# Altium project Node.PrjPCB
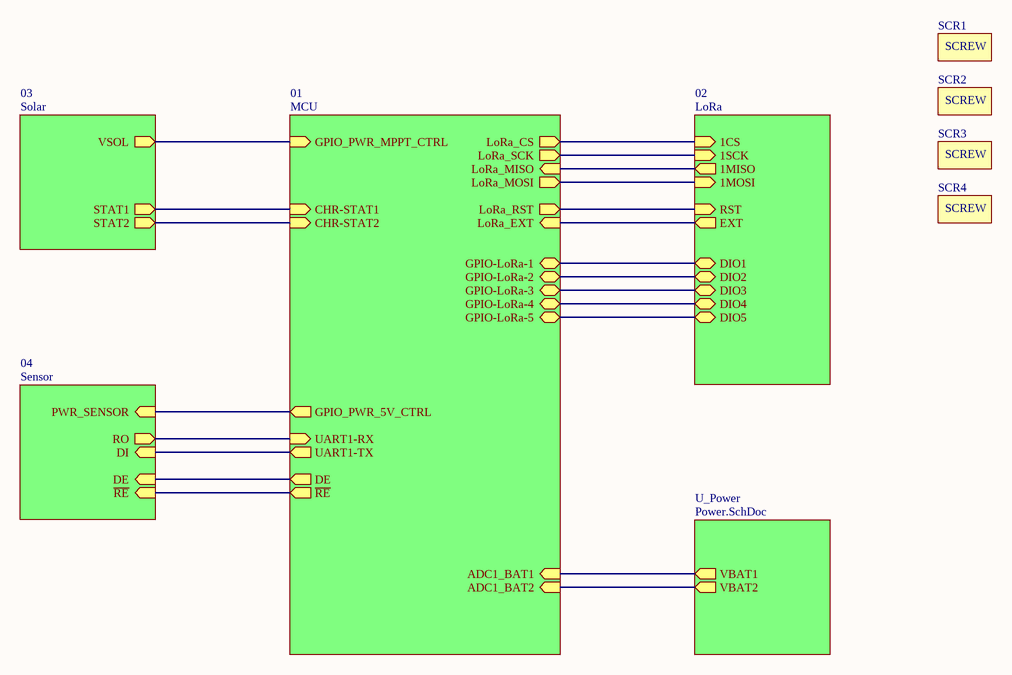
[diagram p0: Main.SchDoc]
6 sheets, 135 parts. Net scope: hierarchical (ports join the sheet entries above them; power ports are global).
Board file: Node_v2.PcbDoc
Sheets:
  Main.SchDoc
    03 = Solar.SchDoc
    01 = MCU.SchDoc
    02 = LoRa.SchDoc
    04 = Sensor.SchDoc
    U_Power = Power.SchDoc

## Sheet Main.SchDoc: =ProjectName
size A4; CheckedBy: DatNB; Author: Ven; CompanyName: Nacentech; Organization: IMET

### Parts
SCR1  Screw 3mm  [SCREW]  (value not drawn)
SCR2  Screw 3mm  [SCREW]  (value not drawn)
SCR3  Screw 3mm  [SCREW]  (value not drawn)
SCR4  Screw 3mm  [SCREW]  (value not drawn)

### Sub-sheets
01 = MCU: LoRa_MOSI (out), LoRa_MISO (in), GPIO-LoRa-3 (bidir), GPIO-LoRa-4 (bidir), CHR-STAT2 (in), CHR-STAT1 (in), DE (out), UART1-TX (out), GPIO-LoRa-1 (bidir), GPIO-LoRa-2 (bidir), ADC1_BAT2 (in), ADC1_BAT1 (in), LoRa_RST (out), LoRa_CS (out), LoRa_EXT (in), GPIO-LoRa-5 (bidir), UART1-RX (in), LoRa_SCK (out), ~{RE} (out), GPIO_PWR_5V_CTRL (out), GPIO_PWR_MPPT_CTRL (in)
02 = LoRa: 1CS (in), 1MOSI (in), EXT (out), 1MISO (out), 1SCK (in), RST (in), DIO4 (bidir), DIO5 (bidir), DIO1 (bidir), DIO3 (bidir), DIO2 (bidir)
03 = Solar: STAT1 (out), VSOL (out), STAT2 (out)
04 = Sensor: ~{RE} (in), RO (out), DI (in), DE (in), PWR_SENSOR (in)
U_Power = Power.SchDoc: VBAT1 (out), VBAT2 (out)

### Nets
NetC5_1: sheet 01/ADC1_BAT1, sheet U_Power/VBAT1
NetC6_1: sheet 01/ADC1_BAT2, sheet U_Power/VBAT2
NetIC2_2: sheet 01/~{RE}, sheet 04/~{RE}
NetIC2_3: sheet 01/DE, sheet 04/DE
NetR4_2: sheet 01/GPIO-LoRa-1, sheet 02/DIO1
NetR15_2: sheet 01/UART1-RX, sheet 04/RO
NetR17_2: sheet 01/GPIO_PWR_5V_CTRL, sheet 04/PWR_SENSOR
NetR18_2: sheet 01/UART1-TX, sheet 04/DI
NetR42_1: sheet 03/STAT1, sheet 01/CHR-STAT1
NetR43_1: sheet 03/STAT2, sheet 01/CHR-STAT2
NetR46_2: sheet 03/VSOL, sheet 01/GPIO_PWR_MPPT_CTRL
NetU1_4: sheet 01/LoRa_RST, sheet 02/RST
NetU1_5: sheet 01/LoRa_EXT, sheet 02/EXT
NetU1_7: sheet 01/GPIO-LoRa-2, sheet 02/DIO2
NetU1_8: sheet 01/GPIO-LoRa-3, sheet 02/DIO3
NetU1_10: sheet 01/GPIO-LoRa-4, sheet 02/DIO4
NetU1_11: sheet 01/GPIO-LoRa-5, sheet 02/DIO5
NetU1_12: sheet 01/LoRa_SCK, sheet 02/1SCK
NetU1_13: sheet 01/LoRa_MISO, sheet 02/1MISO
NetU1_14: sheet 01/LoRa_MOSI, sheet 02/1MOSI
NetU1_15: sheet 01/LoRa_CS, sheet 02/1CS

Not connected (* = marked no-connect by the designer): SCR1 0; SCR2 0; SCR3 0; SCR4 0

### Notes on the sheet
- Project:
- Page Contents:
- Size:
- Date:
- A4
- Checked by:
- Time:
- Revision:
- Sheet
- of
- File:
- (in symbol screw3m) SCREW

### Library data of the parts
SCR1-SCR4 = screw3m

## Sheet Solar.SchDoc: =ProjectName
size A4; CheckedBy: DatNB; Author: Ven; CompanyName: Nacentech; Organization: IMET
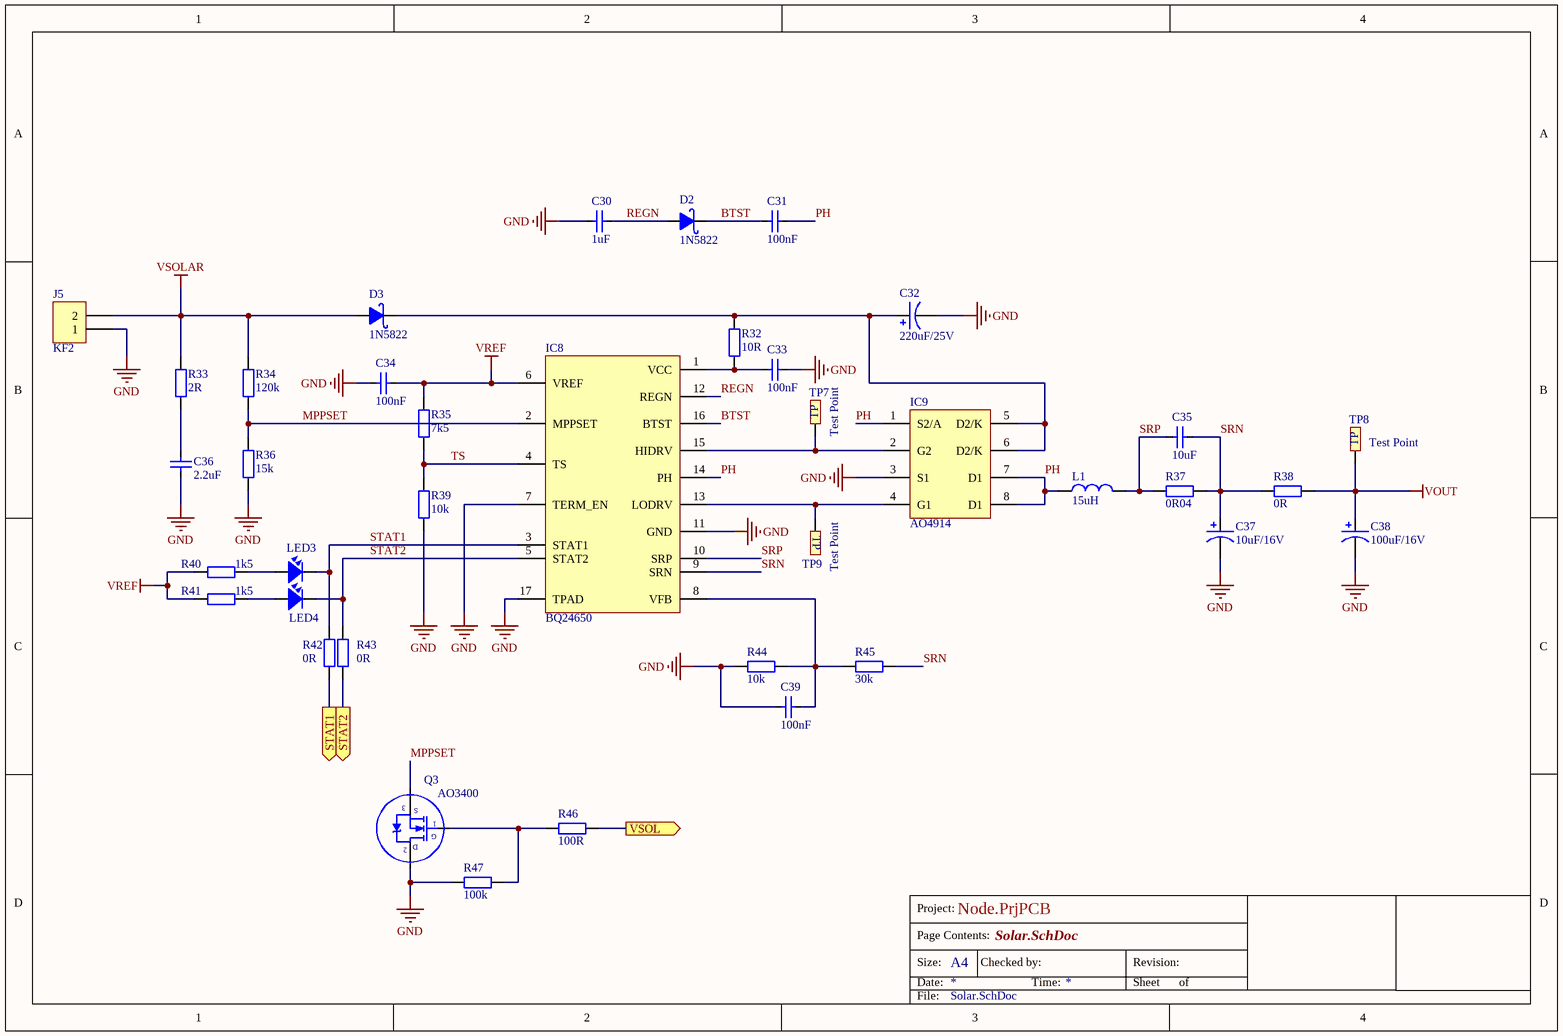
[diagram p1: Solar.SchDoc]

### Parts
C30  1uF  [CAP_0805]
C31  100nF  [CAP_0805]
C32  220uF/25V  [C5mm]
C33  100nF  [CAP_0805]
C34  100nF  [CAP_0805]
C35  10uF  [CAP_0805]
C36  2.2uF  [CAP_0805]
C37  10uF/16V  [C5mm]
C38  100uF/16V  [C5mm]
C39  100nF  [CAP_0805]
D2  1N5822  [DIO-214AC(SMA)]
D3  1N5822  [DIO-214AC(SMA)]
IC8  BQ24650  [VQFN-16]
IC9  AO4914  [SOIC-8]
J5  KF2  [KF2-5.08]
L1  15uH  [L-SMD-M-7.3x4.5]
LED3  LED  [LED-0805-Red]  (value not drawn)
LED4  LED  [LED-0805-Orange]  (value not drawn)
Q3  AO3400  [SOT23A]
R32  10R  [RES-SMD-0805]
R33  2R  [RES-SMD-0805]
R34  120k  [RES-SMD-0805]
R35  7k5  [RES-SMD-0805]
R36  15k  [RES-SMD-0805]
R37  0R04  [RES-SMD-2512]
R38  0R  [RES-SMD-2512]
R39  10k  [RES-SMD-0805]
R40  1k5  [RES-SMD-0805]
R41  1k5  [RES-SMD-0805]
R42  0R  [RES-SMD-0805]
R43  0R  [RES-SMD-0805]
R44  10k  [RES-SMD-0805]
R45  30k  [RES-SMD-0805]
R46  100R  [RES-SMD-0805]
R47  100k  [RES-SMD-0805]
TP7  Test Point  [TP_SMD]
TP8  Test Point  [TP_SMD]
TP9  Test Point  [TP_SMD]

### Ports
STAT1 (out), STAT2 (out), VSOL (out)

### Nets
GND: C30.2 C32.2 C33.2 C34.2 C36.1 C37.2 C38.2 C39.1 IC8.7(TERM_EN) IC8.11(GND) IC8.17(TPAD) IC9.3(S1) J5.1 Q3.2(D) R36.2 R39.1 R44.1 R47.2
VOUT: C38.1 R38.2 TP8.1
VREF: C34.1 IC8.6(VREF) R35.1 R40.1 R41.1
VSOLAR: D3.1(A) J5.2 R33.1 R34.2
BTST: C31.1 D2.2(K) IC8.16(BTST)
MPPSET: IC8.2(MPPSET) Q3.3(S) R34.1 R36.1
PH: C31.2 IC8.14(PH) IC9.1(S2/A) IC9.7(D1) IC9.8(D1) L1.1
REGN: C30.1 D2.1(A) IC8.12(REGN)
SRN: C35.1 C37.1 IC8.9(SRN) R37.2 R38.1 R45.1
SRP: C35.2 IC8.10(SRP) L1.2 R37.1
STAT1: IC8.3(STAT1) LED3.2 R42.2
STAT2: IC8.5(STAT2) LED4.2 R43.2
TS: IC8.4(TS) R35.2 R39.2
NetC32_1: C32.1 D3.2(K) IC9.5(D2/K) IC9.6(D2/K) R32.1
NetC33_1: C33.1 IC8.1(VCC) R32.2
NetC36_2: C36.2 R33.2
NetC39_2: C39.2 IC8.8(VFB) R44.2 R45.2
NetIC8_13: IC8.13(LODRV) IC9.4(G1) TP9.1
NetIC8_15: IC8.15(HIDRV) IC9.2(G2) TP7.1
NetLED3_1: LED3.1 R40.2
NetLED4_1: LED4.1 R41.2
NetQ3_1: Q3.1(G) R46.1 R47.1
NetR42_1: R42.1 ; port STAT1
NetR43_1: R43.1 ; port STAT2
NetR46_2: R46.2 ; port VSOL

### Notes on the sheet
- Project:
- Page Contents:
- Size:
- Date:
- A4
- Checked by:
- Time:
- Revision:
- Sheet
- of
- File:

### Library data of the parts
C30 C31 C33-C36 C39 = CapSMD: Capacitor; Value: 33p; Published: 8-Jun-2000; LatestRevisionDate: 17-Jul-2002; LatestRevisionNote: Re-released for DXP Platform.; PackageReference: RAD-0.3; Publisher: Altium Limited
C32 C37 C38 = Cap Pol: Polarized Capacitor (Axial); Published: 8-Jun-2000; LatestRevisionDate: 17-Jul-2002; LatestRevisionNote: Re-released for DXP Platform.; PackageReference: POLAR0.8; Publisher: Altium Limited
D2 D3 = 1N5822: Schottky Rectifiers; Value: Diode c?m 1N5408
IC8 = BQ24650: BQ24650 Stand-Alone Synchronous Buck Battery Charge Controller for Solar Power / With Maximum Power Point Tracking
IC9 = AO4914: Dual N-Channel Enhancement Mode Field Effect Transistor with Schottky Diode
J5 = KF2: Manufacturer: Würth Elektronik eiSos GmbH; partNo: 691103110002; ComponentLink1 Description: Manufacturer; ComponentLink2 Description: Datasheet; NoPins: 2; Created Date: 29 October 2013; ComponentLink1URL: http://www.we-online.com; ComponentLink2URL: http://katalog.we-online.de/em/datasheet/6911031100xx.pdf; Created by: Karrer Zheng
L1 = Inductor: Value: 150 mH
LED3 LED4 = LED: LED Single colour Green and Red; Value: LED 3 ly Single Colour
Q3 = MOSFET_N: Generic N Channel MOSFET
R32-R47 = Resistor - SMD: Resistor SMD; Manufacturer: Generic Components; Class: Passive; Published: 08/06/2000; Publisher: Altium Hobart Technology Centre
TP7-TP9 = TP: CONNECT 1

## Sheet MCU.SchDoc: =ProjectName
size A4; CheckedBy: DatNB; Author: Ven; CompanyName: Nacentech; Organization: IMET
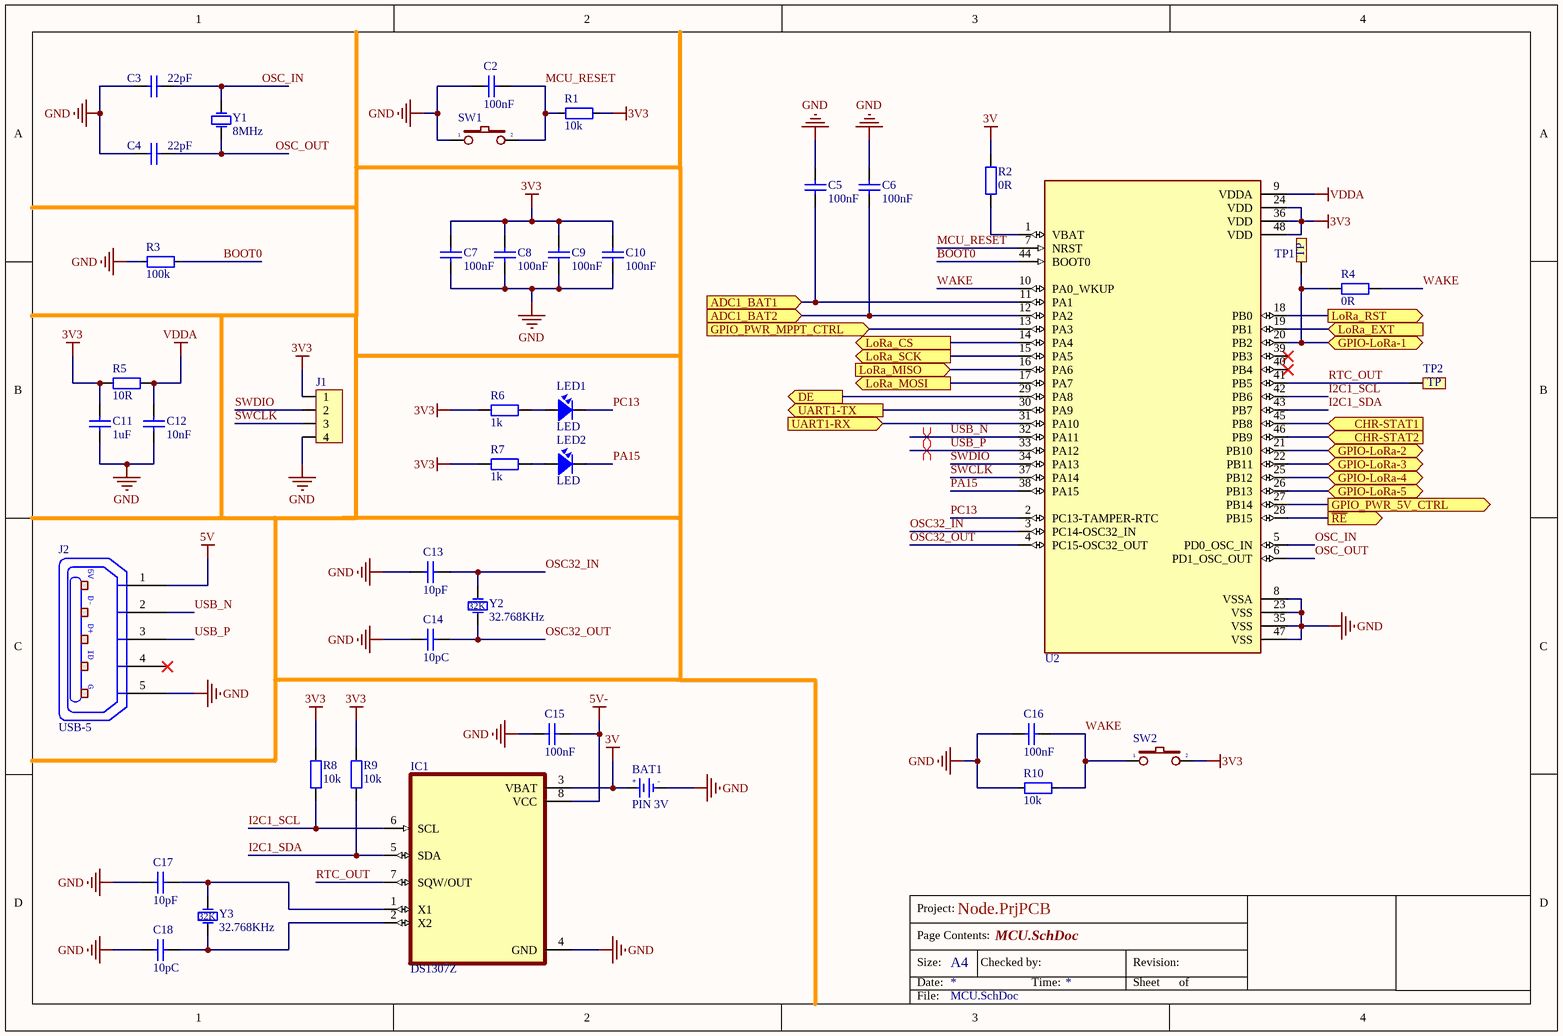
[diagram p2: MCU.SchDoc]

### Parts
BAT1  PIN 3V  [CR1220 SMD]
C2  100nF  [CAP_0805]
C3  22pF  [CAP_0805]
C4  22pF  [CAP_0805]
C5  100nF  [CAP_0805]
C6  100nF  [CAP_0805]
C7  100nF  [CAP_0805]
C8  100nF  [CAP_0805]
C9  100nF  [CAP_0805]
C10  100nF  [CAP_0805]
C11  1uF  [CAP_0805]
C12  10nF  [CAP_0805]
C13  10pF  [CAP_0805]
C14  10pC  [CAP_0805]
C15  100nF  [CAP_0805]
C16  100nF  [CAP_0805]
C17  10pF  [CAP_0805]
C18  10pC  [CAP_0805]
IC1  DS1307Z  [SOIC-8]
J1  ST_Link  [HEADER4P-1.25]  (value not drawn)
J2  USB-5  [USB-M1]
LED1  LED  [LED-0805-Red]
LED2  LED  [LED-0805-Yellow]
R1  10k  [RES-SMD-0805]
R2  0R  [RES-SMD-0805]
R3  100k  [RES-SMD-0805]
R4  0R  [RES-SMD-0805]
R5  10R  [RES-SMD-0805]
R6  1k  [RES-SMD-0805]
R7  1k  [RES-SMD-0805]
R8  10k  [RES-SMD-0805]
R9  10k  [RES-SMD-0805]
R10  10k  [RES-SMD-0805]
SW1  SW  [SW 3x2x4]  (value not drawn)
SW2  SW  [SW 3x2x4]  (value not drawn)
TP1  Test Point  [TP_SMD]  (value not drawn)
TP2  Test Point  [TP_SMD]  (value not drawn)
U2  STM32  [LQFP 48]  (value not drawn)
Y1  8MHz  [XTAL]
Y2  32.768KHz  [XTAL32K]
Y3  32.768KHz  [XTAL32K]

### Ports
ADC1_BAT1 (in), ADC1_BAT2 (in), CHR-STAT1 (in), CHR-STAT2 (in), DE (out), GPIO-LoRa-1 (bidir), GPIO-LoRa-2 (bidir), GPIO-LoRa-3 (bidir), GPIO-LoRa-4 (bidir), GPIO-LoRa-5 (bidir), GPIO_PWR_5V_CTRL (out), GPIO_PWR_MPPT_CTRL (in), LoRa_CS (out), LoRa_EXT (in), LoRa_MISO (in), LoRa_MOSI (out), LoRa_RST (out), LoRa_SCK (out), UART1-RX (in), UART1-TX (out), ~{RE} (out)

### Nets
3V: BAT1.1(+3V) IC1.3(VBAT) R2.2
3V3: C7.2 C8.2 C9.2 C10.2 C11.2 J1.1 R1.1 R5.1 R6.1 R7.1 R8.2 R9.2 SW2.2 U2.24(VDD) U2.36(VDD) U2.48(VDD)
5V: J2.1(P1)
5V-: C15.2 IC1.8(VCC)
GND: BAT1.2(GND) C2.1 C3.1 C4.1 C5.2 C6.2 C7.1 C8.1 C9.1 C10.1 C11.1 C12.1 C13.2 C14.2 C15.1 C16.1 C17.2 C18.2 IC1.4(GND) J1.4 J2.5(P5) R3.2 R10.2 SW1.1 U2.8(VSSA) U2.23(VSS) U2.35(VSS) U2.47(VSS)
VDDA: C12.2 R5.2 U2.9(VDDA)
BOOT0: R3.1 U2.44(BOOT0)
I2C1_SCL: IC1.6(SCL) R8.1 U2.42(PB6)
I2C1_SDA: IC1.5(SDA) R9.1 U2.43(PB7)
MCU_RESET: C2.2 R1.2 SW1.2 U2.7(NRST)
OSC32_IN: C13.1 U2.3(PC14-OSC32_IN) Y2.1(OSC1)
OSC32_OUT: C14.1 U2.4(PC15-OSC32_OUT) Y2.2(OSC2)
OSC_IN: C3.2 U2.5(PD0_OSC_IN) Y1.1(OSC1)
OSC_OUT: C4.2 U2.6(PD1_OSC_OUT) Y1.2(OSC2)
PA15: LED2.2 U2.38(PA15)
PC13: LED1.2 U2.2(PC13-TAMPER-RTC)
RTC_OUT: IC1.7(SQW/OUT) TP2.1 U2.41(PB5)
SWCLK: J1.3 U2.37(PA14)
SWDIO: J1.2 U2.34(PA13)
USB_N: J2.2(P2) U2.32(PA11)
USB_P: J2.3(P3) U2.33(PA12)
WAKE: C16.2 R4.1 R10.1 SW2.1 U2.10(PA0_WKUP)
NetC5_1: C5.1 U2.11(PA1) ; port ADC1_BAT1
NetC6_1: C6.1 U2.12(PA2) ; port ADC1_BAT2
NetC17_1: C17.1 IC1.1(X1) Y3.1(OSC1)
NetC18_1: C18.1 IC1.2(X2) Y3.2(OSC2)
NetIC2_2: U2.28(PB15) ; port ~{RE}
NetIC2_3: U2.29(PA8) ; port DE
NetLED1_1: LED1.1 R6.2
NetLED2_1: LED2.1 R7.2
NetR2_1: R2.1 U2.1(VBAT)
NetR4_2: R4.2 TP1.1 U2.20(PB2) ; port GPIO-LoRa-1
NetR15_2: U2.31(PA10) ; port UART1-RX
NetR17_2: U2.27(PB14) ; port GPIO_PWR_5V_CTRL
NetR18_2: U2.30(PA9) ; port UART1-TX
NetR42_1: U2.45(PB8) ; port CHR-STAT1
NetR43_1: U2.46(PB9) ; port CHR-STAT2
NetR46_2: U2.13(PA3) ; port GPIO_PWR_MPPT_CTRL
NetU1_4: U2.18(PB0) ; port LoRa_RST
NetU1_5: U2.19(PB1) ; port LoRa_EXT
NetU1_7: U2.21(PB10) ; port GPIO-LoRa-2
NetU1_8: U2.22(PB11) ; port GPIO-LoRa-3
NetU1_10: U2.25(PB12) ; port GPIO-LoRa-4
NetU1_11: U2.26(PB13) ; port GPIO-LoRa-5
NetU1_12: U2.15(PA5) ; port LoRa_SCK
NetU1_13: U2.16(PA6) ; port LoRa_MISO
NetU1_14: U2.17(PA7) ; port LoRa_MOSI
NetU1_15: U2.14(PA4) ; port LoRa_CS

Not connected (* = marked no-connect by the designer): J2 4(P4)*; U2 39(PB3)* 40(PB4)*

### Layout directives
differential pair: USB_N, USB_P

### Notes on the sheet
- Project:
- Page Contents:
- Size:
- Date:
- A4
- Checked by:
- Time:
- Revision:
- Sheet
- of
- File:
- (in symbol USB-5) 5V; D-; D+; ID; G
- (in symbol XTAL/32KHz) 32K

### Library data of the parts
BAT1 = PIN 3V: Battery 3VDC; Value: PIN 3V
C2-C18 = CapSMD: Capacitor; Value: 33p; Published: 8-Jun-2000; LatestRevisionDate: 17-Jul-2002; LatestRevisionNote: Re-released for DXP Platform.; PackageReference: RAD-0.3; Publisher: Altium Limited
J1 = Header4: Header IDC, 4 x 1 Pin Vertical 2.54mm Pitch (Non-Boxed, Male); Manufacturer: W¨¹rth Elektronik eiSos GmbH; partNo: 613002143121; ComponentLink1 Description: Manufacturer; ComponentLink2 Description: Datasheet; NoPins: 02; Created Date: 29 March 2013; ComponentLink1URL: http://www.we-online.com; ComponentLink2URL: http://katalog.we-online.de/em/datasheet/6130xx143121.pdf; Created by: Karrer Zheng
J2 = USB-5: Manufacturer: FCI; Manufacturer Part Number: 10118193-0001LF; Connector Type: USB - micro B; Number of Contacts: 5; Gender: Receptacle; Specifications: USB 2.0; .Creator: MM; .Checked PCB: RF; Supplier 1: Digi-Key; RoHS: RoHS Compliant; Category: Connectors, Interconnects; Stock 1: 28642; Pricing 1: 1=0.46, 10=0.433, 25=0.3712, 50=0.3156, 100=0.3032, 250=0.27224, 500=0.25988 (USD); Packaging: Cut Tape (CT); Mounting Type: Surface Mount, Right Angle, Horizontal; Features: Shielded, Solder Retention; Ingress Protection: -; ComponentLink1URL: http://portal.fciconnect.com/Comergent//fci/drawing/10118193.pdf; ComponentLink1Description: http://portal.fciconnect.com/Comergent//fci/drawing/10118193.pdf; Supplier Part Number 1: 609-4616-1-ND; .Checked SCH: MM
LED1 LED2 = LED: as LED3 on sheet Solar
R1 R3 R10 = Resistor - SMD: Resistor; Manufacturer: Generic Components; Class: Passive; Published: 08/06/2000; Publisher: Altium Hobart Technology Centre
R2 R4-R9 = Resistor - SMD: as R32 on sheet Solar; Published: 08/06/2000; Publisher: Altium Hobart Technology Centre
SW1 SW2 = SW2: Switch button 2 pin; Value: SW chip 2 pin
TP1 TP2 = TP: CONNECT 1
U2 = STM32F103C8T6: STM32 ARM-based 32-bit MCU with 64 Kbytes Flash, 64-pin LQFP, Industrial Temperature
Y1 = XTAL: Crystal Oscillator; Published: 8-Jun-2000; LatestRevisionDate: 17-Jul-2002; LatestRevisionNote: Re-released for DXP Platform.; PackageReference: R38; Publisher: Altium Limited
Y2 Y3 = XTAL/32KHz: Crystal Oscillator; Published: 8-Jun-2000; LatestRevisionDate: 17-Jul-2002; LatestRevisionNote: Re-released for DXP Platform.; PackageReference: R38; Publisher: Altium Limited

## Sheet LoRa.SchDoc: =ProjectName
size A4; CheckedBy: DatNB; Author: Ven; CompanyName: Nacentech; Organization: IMET
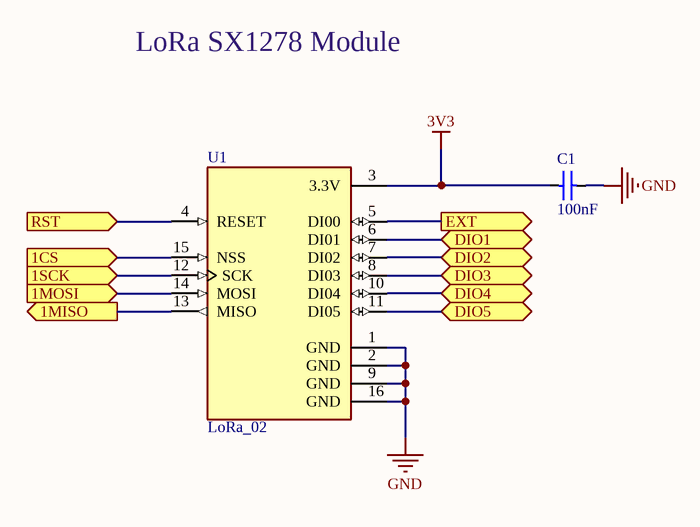
[diagram p3: LoRa.SchDoc]

### Parts
C1  100nF  [CAP_0805]
U1  LoRa_02  [Ra-02]

### Ports
1CS (in), 1MISO (out), 1MOSI (in), 1SCK (in), DIO1 (bidir), DIO2 (bidir), DIO3 (bidir), DIO4 (bidir), DIO5 (bidir), EXT (out), RST (in)

### Nets
3V3: C1.1 U1.3(3.3V)
GND: C1.2 U1.1(GND) U1.2(GND) U1.9(GND) U1.16(GND)
NetR4_2: U1.6(DI01) ; port DIO1
NetU1_4: U1.4(RESET) ; port RST
NetU1_5: U1.5(DI00) ; port EXT
NetU1_7: U1.7(DI02) ; port DIO2
NetU1_8: U1.8(DI03) ; port DIO3
NetU1_10: U1.10(DI04) ; port DIO4
NetU1_11: U1.11(DI05) ; port DIO5
NetU1_12: U1.12(SCK) ; port 1SCK
NetU1_13: U1.13(MISO) ; port 1MISO
NetU1_14: U1.14(MOSI) ; port 1MOSI
NetU1_15: U1.15(NSS) ; port 1CS

### Notes on the sheet
- LoRa SX1278 Module
- Project:
- Page Contents:
- Size:
- Date:
- A4
- Checked by:
- Time:
- Revision:
- Sheet
- of
- File:

### Library data of the parts
C1 = CapSMD: Capacitor; Value: 33p; Published: 8-Jun-2000; LatestRevisionDate: 17-Jul-2002; LatestRevisionNote: Re-released for DXP Platform.; PackageReference: RAD-0.3; Publisher: Altium Limited

## Sheet Sensor.SchDoc: =ProjectName
size A4; CheckedBy: DatNB; Author: Ven; CompanyName: Nacentech; Organization: IMET
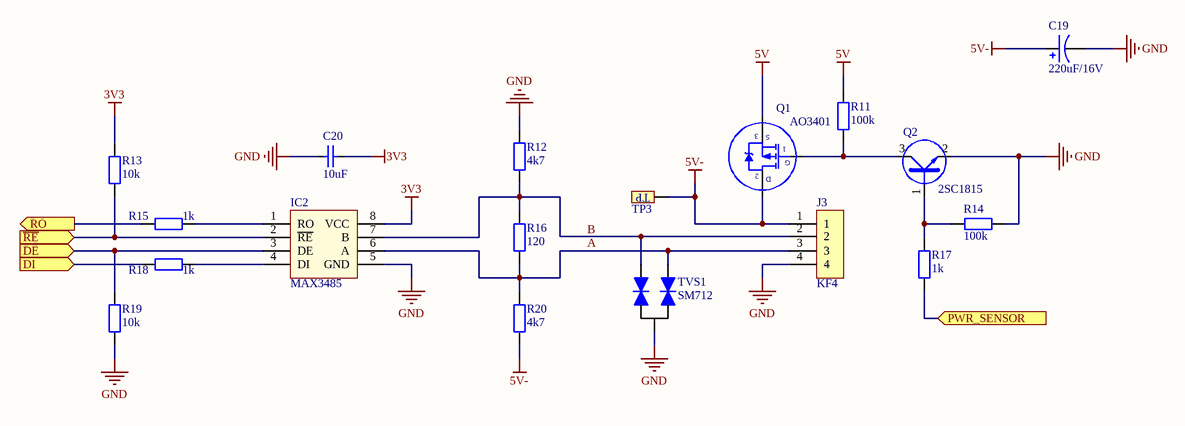
[diagram p4: Sensor.SchDoc]

### Parts
C19  220uF/16V  [C5mm]
C20  10uF  [CAP_0805]
IC2  MAX3485  [SO-8]
J3  KF4  [KF4-5.08]
Q1  AO3401  [SOT23A]
Q2  2SC1815  [SOT23D]
R11  100k  [RES-SMD-0805]
R12  4k7  [RES-SMD-0805]
R13  10k  [RES-SMD-0805]
R14  100k  [RES-SMD-0805]
R15  1k  [RES-SMD-0805]
R16  120  [RES-SMD-0805]
R17  1k  [RES-SMD-0805]
R18  1k  [RES-SMD-0805]
R19  10k  [RES-SMD-0805]
R20  4k7  [RES-SMD-0805]
TP3  Test Point  [TP_SMD]  (value not drawn)
TVS1  SM712  [SOT23]

### Ports
DE (in), DI (in), PWR_SENSOR (in), RO (out), ~{RE} (in)

### Nets
3V3: C20.2 IC2.8(VCC) R13.1
5V: Q1.3(S) R11.1
5V-: C19.1 J3.1 Q1.2(D) R20.1 TP3.1
GND: C19.2 C20.1 IC2.5(GND) J3.4 Q2.2(E) R12.2 R14.2 R19.2 TVS1.3(K)
A: IC2.6(A) J3.3 R16.1 R20.2 TVS1.1(A)
NetIC2_1: IC2.1(RO) R15.1
NetIC2_2: IC2.2(~{RE}) R13.2 ; port ~{RE}
NetIC2_3: IC2.3(DE) R19.1 ; port DE
NetIC2_4: IC2.4(DI) R18.1
NetIC2_7: IC2.7(B) J3.2 R12.1 R16.2 TVS1.2(A)
NetQ1_1: Q1.1(G) Q2.3(C) R11.2
NetQ2_1: Q2.1(B) R14.1 R17.1
NetR15_2: R15.2 ; port RO
NetR17_2: R17.2 ; port PWR_SENSOR
NetR18_2: R18.2 ; port DI

### Notes on the sheet
- Labels drawn without touching a wire or pin: B
- Project:
- Page Contents:
- Size:
- Date:
- A4
- Checked by:
- Time:
- Revision:
- Sheet
- of
- File:

### Library data of the parts
C19 = Cap Pol: Polarized Capacitor (Axial); Published: 8-Jun-2000; LatestRevisionDate: 17-Jul-2002; LatestRevisionNote: Re-released for DXP Platform.; PackageReference: POLAR0.8; Publisher: Altium Limited
C20 = CapSMD: Capacitor; Value: 33p; Published: 8-Jun-2000; LatestRevisionDate: 17-Jul-2002; LatestRevisionNote: Re-released for DXP Platform.; PackageReference: RAD-0.3; Publisher: Altium Limited
IC2 = MAX485: RS232 - RS485 (Same sn75176)
J3 = KF4: Manufacturer: W¨¹rth Elektronik eiSos GmbH; PartNo: 691133710004; ComponentLink1 Description: Manufacturer; ComponentLink2 Description: Datasheet; NoPins: 4; ComponentLink1 URL: http://www.we-online.com; ComponentLink2 URL: http://katalog.we-online.de/em/datasheet/6911337100xx.pdf; Created By: Baojun Chen; Created Date: 4-Aug-15
Q1 = MOSFET_P: 30V 5.8A P-Channel MOSFET
Q2 = C1815: NPN 600mW, ECB; Value: C1815
R11-R20 = Resistor - SMD: as R32 on sheet Solar; Published: 08/06/2000; Publisher: Altium Hobart Technology Centre
TP3 = TP: CONNECT 1
TVS1 = BAV70: Value: 1N4148

## Sheet Power.SchDoc: =ProjectName
size A4; CheckedBy: DatNB; Author: Ven; CompanyName: Nacentech; Organization: IMET
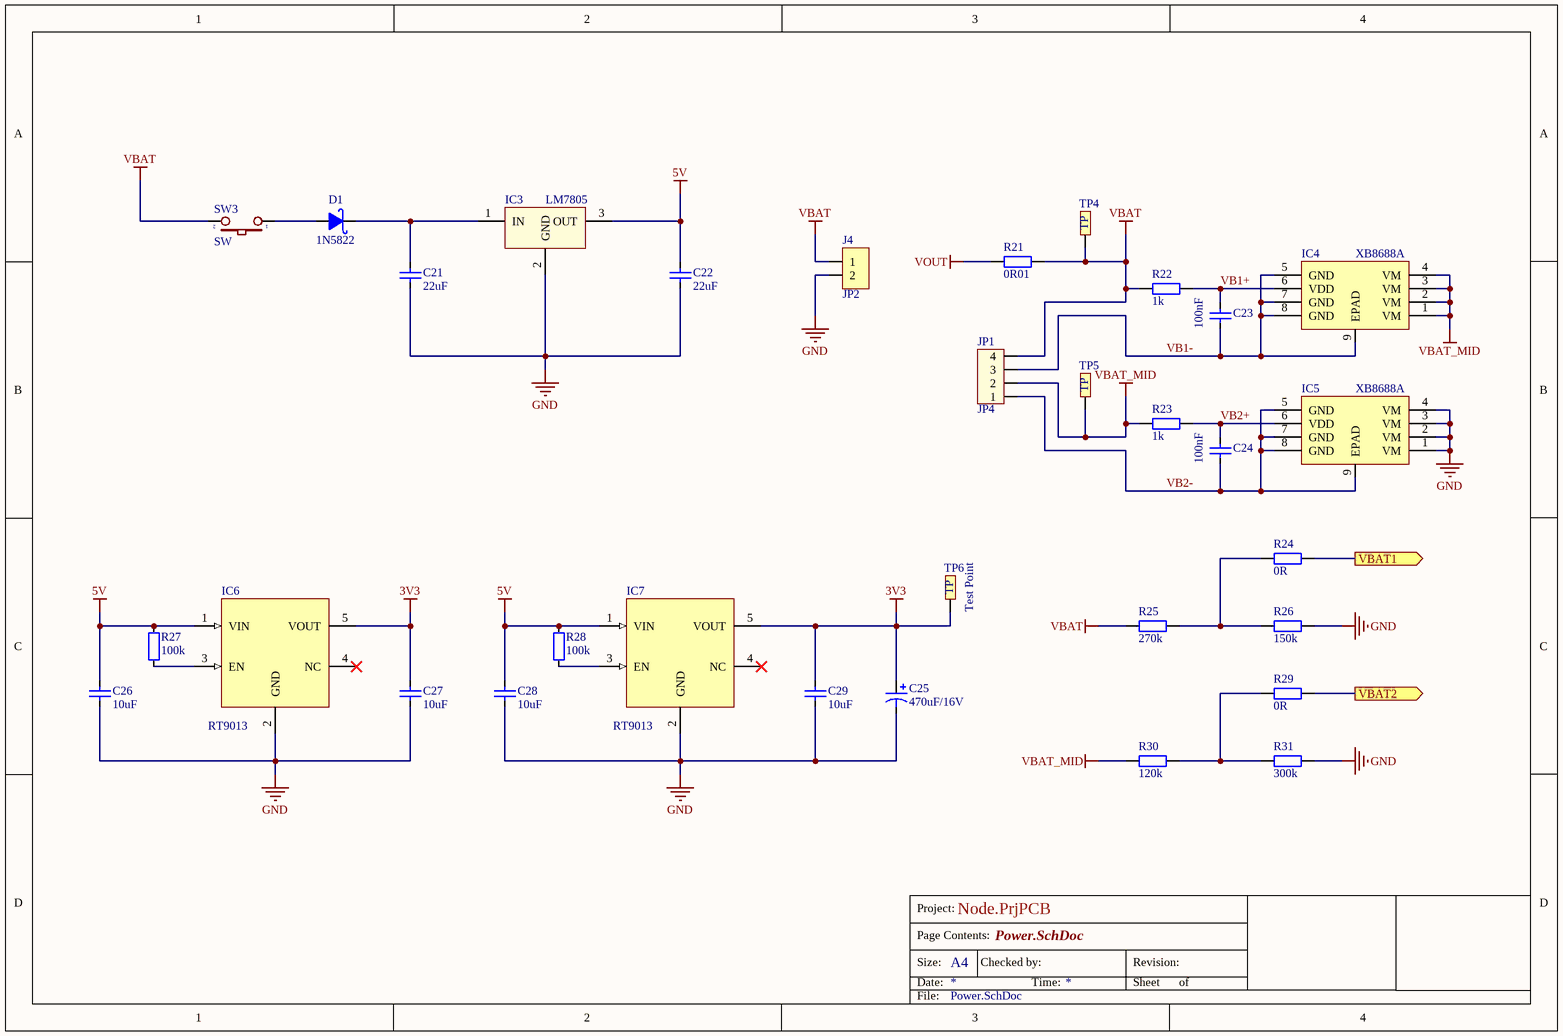
[diagram p5: Power.SchDoc]

### Parts
C21  22uF  [CAP_0805]
C22  22uF  [CAP_0805]
C23  100nF  [CAP_0805]
C24  100nF  [CAP_0805]
C25  470uF/16V  [C8mm]
C26  10uF  [CAP_0805]
C27  10uF  [CAP_0805]
C28  10uF  [CAP_0805]
C29  10uF  [CAP_0805]
D1  1N5822  [DIO-214AC(SMA)]
IC3  LM7805  [TO-252]
IC4  XB8688A  [SOP8-PP]
IC5  XB8688A  [SOP8-PP]
IC6  RT9013  [SOT23-5]
IC7  RT9013  [SOT23-5]
J4  JP2  [JP2-D1T]
JP1  JP4  [CON4]
R21  0R01  [RES-SMD-2512]
R22  1k  [RES-SMD-0805]
R23  1k  [RES-SMD-0805]
R24  0R  [RES-SMD-0805]
R25  270k  [RES-SMD-0805]
R26  150k  [RES-SMD-0805]
R27  100k  [RES-SMD-0805]
R28  100k  [RES-SMD-0805]
R29  0R  [RES-SMD-0805]
R30  120k  [RES-SMD-0805]
R31  300k  [RES-SMD-0805]
SW3  SW  [SW102]
TP4  Test Point  [TP_SMD]  (value not drawn)
TP5  Test Point  [TP_SMD]  (value not drawn)
TP6  Test Point  [TP_SMD]

### Ports
VBAT1 (out), VBAT2 (out)

### Nets
3V3: C25.1 C27.2 C29.2 IC6.5(VOUT) IC7.5(VOUT) TP6.1
5V: C22.2 C26.2 C28.2 IC3.3(OUT) IC6.1(VIN) IC7.1(VIN) R27.1 R28.1
GND: C21.1 C22.1 C25.2 C26.1 C27.1 C28.1 C29.1 IC3.2(GND) IC5.1(VM) IC5.2(VM) IC5.3(VM) IC5.4(VM) IC6.2(GND) IC7.2(GND) J4.2 R26.1 R31.1
VBAT: J4.1 JP1.4 R21.2 R22.2 R25.2 SW3.2 TP4.1
VBAT_MID: IC4.1(VM) IC4.2(VM) IC4.3(VM) IC4.4(VM) JP1.2 R23.2 R30.2 TP5.1
VOUT: R21.1
VB1+: C23.2 IC4.6(VDD) R22.1
VB1-: C23.1 IC4.5(GND) IC4.7(GND) IC4.8(GND) IC4.9(EPAD) JP1.3
VB2+: C24.2 IC5.6(VDD) R23.1
VB2-: C24.1 IC5.5(GND) IC5.7(GND) IC5.8(GND) IC5.9(EPAD) JP1.1
NetC5_1: R24.1 ; port VBAT1
NetC6_1: R29.1 ; port VBAT2
NetC21_2: C21.2 D1.2(K) IC3.1(IN)
NetD1_1: D1.1(A) SW3.1
NetIC6_3: IC6.3(EN) R27.2
NetIC7_3: IC7.3(EN) R28.2
NetR24_2: R24.2 R25.1 R26.2
NetR29_2: R29.2 R30.1 R31.2

Not connected (* = marked no-connect by the designer): IC6 4(NC)*; IC7 4(NC)*

### Notes on the sheet
- Project:
- Page Contents:
- Size:
- Date:
- A4
- Checked by:
- Time:
- Revision:
- Sheet
- of
- File:

### Library data of the parts
C21-C24 C26-C29 = CapSMD: Capacitor; Value: 33p; Published: 8-Jun-2000; LatestRevisionDate: 17-Jul-2002; LatestRevisionNote: Re-released for DXP Platform.; PackageReference: RAD-0.3; Publisher: Altium Limited
C25 = Cap Pol: Polarized Capacitor (Axial); Published: 8-Jun-2000; LatestRevisionDate: 17-Jul-2002; LatestRevisionNote: Re-released for DXP Platform.; PackageReference: POLAR0.8; Publisher: Altium Limited
D1 = 1N5822: as D2 on sheet Solar
IC3 = LM78xx: LDO to 5V; Value: LM7805
IC4 IC5 = XB8688: One Cell Lithium-ion/Polymer Battery Protection IC
IC6 IC7 = RT9013: RT9013-33GB IC REG LINEAR 3.3V 500mA SOT23-5
J4 = JP2: WR-PHD 2.54 mm Angled Socket Header; Manufacturer: W¨¹rth Elektronik eiSos GmbH; partNo: 613002143121; ComponentLink1 Description: Manufacturer; ComponentLink2 Description: Datasheet; NoPins: 02; Created Date: 29 March 2013; ComponentLink1URL: http://www.we-online.com; ComponentLink2URL: http://katalog.we-online.de/em/datasheet/6130xx143121.pdf; Created by: Karrer Zheng
JP1 = Con4: Connector 4; Value: Connector 4
R21-R26 R29-R31 = Resistor - SMD: as R32 on sheet Solar; Published: 08/06/2000; Publisher: Altium Hobart Technology Centre
R27 R28 = Resistor - SMD: as R1 on sheet MCU; Published: 08/06/2000; Publisher: Altium Hobart Technology Centre
SW3 = SW2: as SW1 on sheet MCU
TP4-TP6 = TP: CONNECT 1

## Nets that join several sheets
3V3: MCU (16 pins), LoRa (C1.1 U1.3), Sensor (C20.2 IC2.8 R13.1), Power (6 pins)
5V: MCU (J2.1), Sensor (Q1.3 R11.1), Power (8 pins)
5V-: MCU (C15.2 IC1.8), Sensor (5 pins)
GND: Solar (18 pins), MCU (28 pins), LoRa (5 pins), Sensor (9 pins), Power (17 pins)
VOUT: Solar (C38.1 R38.2 TP8.1), Power (R21.1)
NetC5_1: MCU (C5.1 U2.11), Power (R24.1)
NetC6_1: MCU (C6.1 U2.12), Power (R29.1)
NetIC2_2: MCU (U2.28), Sensor (IC2.2 R13.2)
NetIC2_3: MCU (U2.29), Sensor (IC2.3 R19.1)
NetR4_2: MCU (R4.2 TP1.1 U2.20), LoRa (U1.6)
NetR15_2: MCU (U2.31), Sensor (R15.2)
NetR17_2: MCU (U2.27), Sensor (R17.2)
NetR18_2: MCU (U2.30), Sensor (R18.2)
NetR42_1: Solar (R42.1), MCU (U2.45)
NetR43_1: Solar (R43.1), MCU (U2.46)
NetR46_2: Solar (R46.2), MCU (U2.13)
NetU1_4: MCU (U2.18), LoRa (U1.4)
NetU1_5: MCU (U2.19), LoRa (U1.5)
NetU1_7: MCU (U2.21), LoRa (U1.7)
NetU1_8: MCU (U2.22), LoRa (U1.8)
NetU1_10: MCU (U2.25), LoRa (U1.10)
NetU1_11: MCU (U2.26), LoRa (U1.11)
NetU1_12: MCU (U2.15), LoRa (U1.12)
NetU1_13: MCU (U2.16), LoRa (U1.13)
NetU1_14: MCU (U2.17), LoRa (U1.14)
NetU1_15: MCU (U2.14), LoRa (U1.15)